# Altium schematic sheet Gumstix.SchDoc
size A
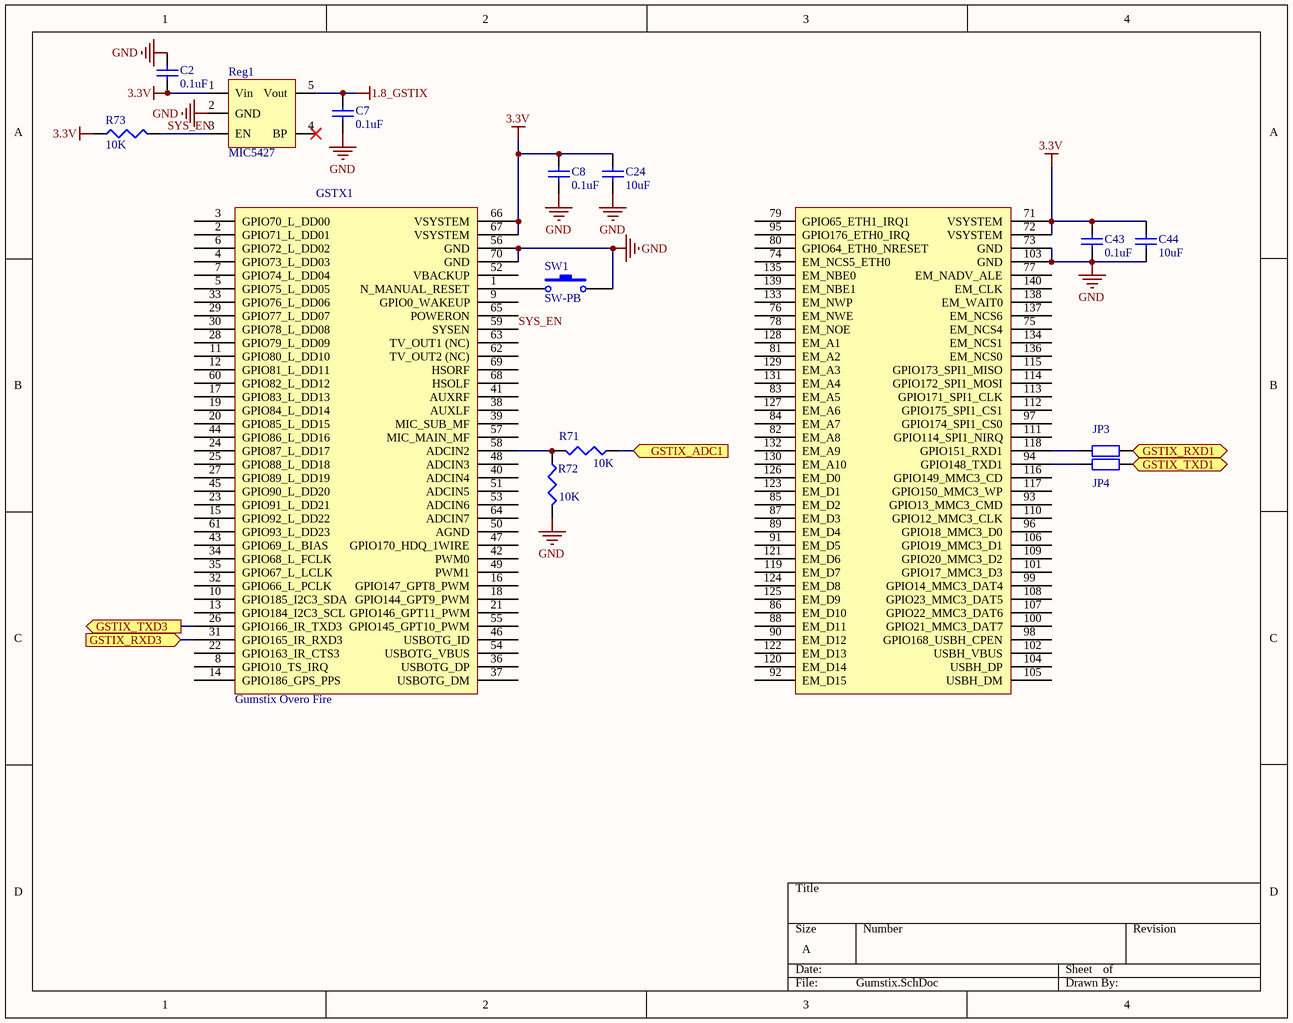
[diagram p0: Gumstix.SchDoc]

## Parts
C2  value 0.1uF  [0603_CAP]  (hidden comment: X7R Cap)
C7  value 0.1uF  [0603_CAP]  (hidden comment: X7R Cap)
C8  value 0.1uF  [0603_CAP]  (hidden comment: X7R Cap)
C24  value 10uF  [0603_CAP]  (hidden comment: X7R Cap)
C43  value 0.1uF  [0603_CAP]  (hidden comment: X7R Cap)
C44  value 10uF  [0603_CAP]  (hidden comment: X7R Cap)
GSTX1  Gumstix Overo Fire  [GUMSTIX]
JP3  (no value)  [0603_RES]
JP4  (no value)  [0603_RES]
R71  value 10K  [0603_RES]  (hidden comment: Rpull)
R72  value 10K  [0603_RES]  (hidden comment: Rpull)
R73  value 10K  [0603_RES]  (hidden comment: Rpull)
Reg1  MIC5427  [SOT23-STD-5-Lead]
SW1  SW-PB  [SM_SW]

## Ports
GSTIX_ADC1 (in), GSTIX_RXD1 (in), GSTIX_RXD3 (in), GSTIX_TXD1 (out), GSTIX_TXD3 (out)

## Nets
1.8_GSTIX: C7.1 Reg1.5(Vout)
3.3V: C2.1 C8.1 C24.1 C43.1 C44.1 GSTX1.66(VSYSTEM) GSTX1.67(VSYSTEM) GSTX1.71(VSYSTEM) GSTX1.72(VSYSTEM) R73.1 Reg1.1(Vin)
GND: C2.2 C7.2 C8.2 C24.2 C43.2 C44.2 GSTX1.56(GND) GSTX1.70(GND) GSTX1.73(GND) GSTX1.103(GND) R72.2 Reg1.2(GND) SW1.2
GSTIX_ADC1: R71.1 ; port GSTIX_ADC1
GSTIX_RXD1: JP3.2 ; port GSTIX_RXD1
GSTIX_RXD3: GSTX1.31(GPIO165_IR_RXD3) ; port GSTIX_RXD3
GSTIX_TXD1: JP4.2 ; port GSTIX_TXD1
GSTIX_TXD3: GSTX1.26(GPIO166_IR_TXD3) ; port GSTIX_TXD3
SYS_EN: GSTX1.59(SYSEN) R73.2 Reg1.3(EN)
NetGSTX1_1: GSTX1.1(N_MANUAL_RESET) SW1.1
NetGSTX1_58: GSTX1.58(ADCIN2) R71.2 R72.1
NetGSTX1_94: GSTX1.94(GPIO148_TXD1) JP4.1
NetGSTX1_118: GSTX1.118(GPIO151_RXD1) JP3.1

Not connected (* = marked no-connect by the designer): GSTX1 2(GPIO71_L_DD01) 3(GPIO70_L_DD00) 4(GPIO73_L_DD03) 5(GPIO75_L_DD05) 6(GPIO72_L_DD02) 7(GPIO74_L_DD04) 8(GPIO10_TS_IRQ) 9(GPIO0_WAKEUP) 10(GPIO185_I2C3_SDA) 11(GPIO80_L_DD10) 12(GPIO81_L_DD11) 13(GPIO184_I2C3_SCL) 14(GPIO186_GPS_PPS) 15(GPIO92_L_DD22) 16(GPIO147_GPT8_PWM) 17(GPIO83_L_DD13) 18(GPIO144_GPT9_PWM) 19(GPIO84_L_DD14) 20(GPIO85_L_DD15) 21(GPIO146_GPT11_PWM) 22(GPIO163_IR_CTS3) 23(GPIO91_L_DD21) 24(GPIO87_L_DD17) 25(GPIO88_L_DD18) 27(GPIO89_L_DD19) 28(GPIO79_L_DD09) 29(GPIO77_L_DD07) 30(GPIO78_L_DD08) 32(GPIO66_L_PCLK) 33(GPIO76_L_DD06) 34(GPIO68_L_FCLK) 35(GPIO67_L_LCLK) 36(USBOTG_DP) 37(USBOTG_DM) 38(AUXLF) 39(MIC_SUB_MF) 40(ADCIN4) 41(AUXRF) 42(PWM0) 43(GPIO69_L_BIAS) 44(GPIO86_L_DD16) 45(GPIO90_L_DD20) 46(USBOTG_ID) 47(GPIO170_HDQ_1WIRE) 48(ADCIN3) 49(PWM1) 50(AGND) 51(ADCIN5) 52(VBACKUP) 53(ADCIN6) 54(USBOTG_VBUS) 55(GPIO145_GPT10_PWM) 57(MIC_MAIN_MF) 60(GPIO82_L_DD12) 61(GPIO93_L_DD23) 62(TV_OUT2_(NC)) 63(TV_OUT1_(NC)) 64(ADCIN7) 65(POWERON) 68(HSOLF) 69(HSORF) 74(EM_NCS5_ETH0) 75(EM_NCS4) 76(EM_NWE) 77(EM_NADV_ALE) 78(EM_NOE) 79(GPIO65_ETH1_IRQ1) 80(GPIO64_ETH0_NRESET) 81(EM_A2) 82(EM_A8) 83(EM_A5) 84(EM_A7) 85(EM_D2) 86(EM_D10) 87(EM_D3) 88(EM_D11) 89(EM_D4) 90(EM_D12) 91(EM_D5) 92(EM_D15) 93(GPIO13_MMC3_CMD) 95(GPIO176_ETH0_IRQ) 96(GPIO18_MMC3_D0) 97(GPIO174_SPI1_CS0) 98(GPIO168_USBH_CPEN) 99(GPIO14_MMC3_DAT4) 100(GPIO21_MMC3_DAT7) 101(GPIO17_MMC3_D3) 102(USBH_VBUS) 104(USBH_DP) 105(USBH_DM) 106(GPIO19_MMC3_D1) 107(GPIO22_MMC3_DAT6) 108(GPIO23_MMC3_DAT5) 109(GPIO20_MMC3_D2) 110(GPIO12_MMC3_CLK) 111(GPIO114_SPI1_NIRQ) 112(GPIO175_SPI1_CS1) 113(GPIO171_SPI1_CLK) 114(GPIO172_SPI1_MOSI) 115(GPIO173_SPI1_MISO) 116(GPIO149_MMC3_CD) 117(GPIO150_MMC3_WP) 119(EM_D7) 120(EM_D14) 121(EM_D6) 122(EM_D13) 123(EM_D1) 124(EM_D8) 125(EM_D9) 126(EM_D0) 127(EM_A6) 128(EM_A1) 129(EM_A3) 130(EM_A10) 131(EM_A4) 132(EM_A9) 133(EM_NWP) 134(EM_NCS1) 135(EM_NBE0) 136(EM_NCS0) 137(EM_NCS6) 138(EM_WAIT0) 139(EM_NBE1) 140(EM_CLK); Reg1 4(BP)*

## Library data of the parts
C2 C7 C8 C24 C43 C44 = Cap: Capacitor; Published: 8-Jun-2000; LatestRevisionDate: 17-Jul-2002; LatestRevisionNote: Re-released for DXP Platform.; PackageReference: RAD-0.3; Publisher: Altium Limited
GSTX1 = GUMSTIX
JP3 JP4 = Res2: Resistor; Published: 8-Jun-2000; LatestRevisionDate: 17-Jul-2002; LatestRevisionNote: Re-released for DXP Platform.; PackageReference: AXIAL-0.4; Publisher: Altium Limited
R71-R73 = Rpull: Resistor; Published: 8-Jun-2000; LatestRevisionDate: 29-May-2009; LatestRevisionNote: IPC-7351 Footprint Added.; PackageReference: J1-0603; Publisher: Altium Limited; PackageDescription: Chip Resistor
Reg1 = 1.8V LDO Regulator: 576-1288-1-ND; Manufacturer: Micrel Inc; Manufacturer Part Number: MIC5247-1.8YM5 TR; Description: IC REG VOLT 150MA 1.8V SOT23-5; Regulator Topology: Positive Fixed; Voltage - Output: 1.8V; Voltage - Input: 2.7 V ~ 6 V; Voltage - Dropout (Typical): 0.15V @ 150mA; Number of Regulators: 1; Current - Output: 150mA; Current - Limit (Min): 160mA; Supplier Part Number 1: 576-1288-1-ND; Supplier 1: Digi-Key; RoHS: RoHS Compliant; Category: Integrated Circuits (ICs); Stock 1: 11342; Pricing 1: 1=0.9, 25=0.75, 100=0.6, 250=0.45, 500=0.42 (USD); Operating Temperature: -40°C ~ 125°C; Mounting Type: Surface Mount; Package / Case: SC-74A, SOT-753; Supplier Device Package: SOT-23-5; Packaging: Cut Tape (CT); ComponentLink1URL: http://www.micrel.com/_PDF/mic5247.pdf; ComponentLink1Description: http://www.micrel.com/_PDF/mic5247.pdf
SW1 = SW-PB: Switch; Manufacturer: C&K Components; Manufacturer Part Number: PTS525SK08SMTR LFS; Description: SWITCH TACTILE SPST-NO 0.05A 12V; Circuit: SPST-NO; Switch Function: Off-Mom; Contact Rating @ Voltage: 0.05A @ 12VDC; Actuator Type: Standard; Outline: 5.25mm x 5.25mm; Illumination: Non-Illuminated; Operating Force: 260gf; Published: 24-Mar-1999; LatestRevisionDate: 17-Jul-2002; LatestRevisionNote: Re-released for DXP Platform.; PackageReference: SPST-2; Publisher: Altium Limited; RoHS: RoHS Compliant; Category: Switches; Mounting Type: Surface Mount; Termination Style: Gull Wing; Orientation: Vertical; Packaging: Cut Tape (CT); ComponentLink1URL: http://www.ck-components.com/index.php?module=media&action=Display&cmpref=14407&lang=en&width=&height=&format=&alt=; ComponentLink1Description: http://www.ck-components.com/index.php?module=media&action=Display&cmpref=14407&lang=en&width=&height=&format=&alt=; Supplier 1: Sparkfun; Supplier Part Number 1: COM-08229